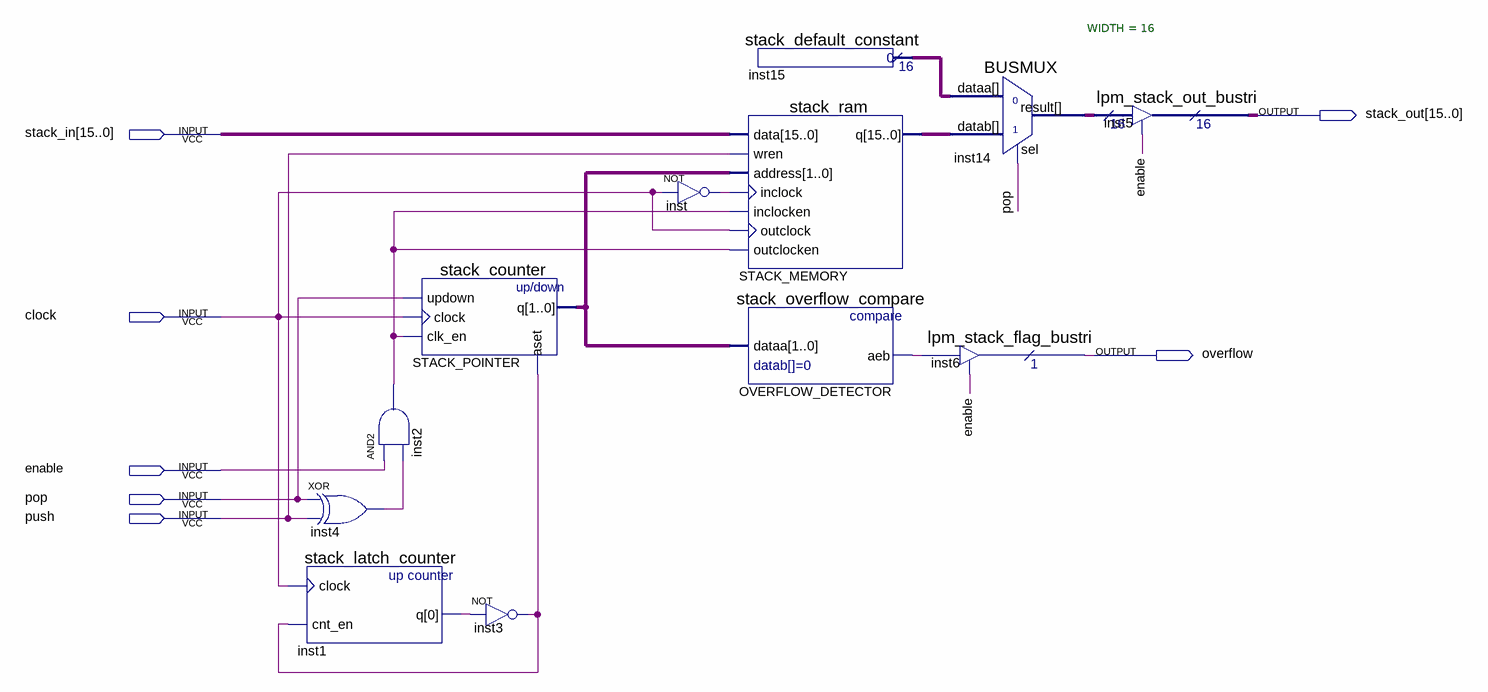
[diagram p0: schematic sheet]
// Quartus schematic Stack.bdf as structural Verilog: 12 symbols, 7 pins
module Stack (
  input  [15:0] stack_in,
  input  clock,
  input  enable,
  input  pop,
  input  push,
  output [15:0] stack_out,
  output overflow
);

  wire inst1_q, inst2_out, inst3_out, inst4_out, inst_out, OVERFLOW_DETECTOR_aeb;
  wire [1:0] STACK_POINTER_q;
  wire [15:0] inst14_result, inst15_result, STACK_MEMORY_q;

  xor inst4 (inst4_out, pop, push);
  stack_latch_counter inst1 (.clock(clock), .cnt_en(inst3_out), .q(inst1_q));
  and inst2 (inst2_out, enable, inst4_out);
  stack_counter STACK_POINTER (.updown(pop), .clock(clock), .clk_en(inst2_out), .aset(inst3_out), .q(STACK_POINTER_q));
  not inst3 (inst3_out, inst1_q);
  not inst (inst_out, clock);
  stack_default_constant inst15 (.result(inst15_result));
  stack_ram STACK_MEMORY (
    .data(stack_in), .wren(push), .address(STACK_POINTER_q), .inclock(inst_out), .inclocken(inst2_out),
    .outclock(clock), .outclocken(inst2_out), .q(STACK_MEMORY_q));
  stack_overflow_compare OVERFLOW_DETECTOR (.dataa(STACK_POINTER_q), .aeb(OVERFLOW_DETECTOR_aeb));
  lpm_stack_flag_bustri inst6 (.enabledt(enable), .data(OVERFLOW_DETECTOR_aeb), .tridata(overflow));
  BUSMUX #(.WIDTH(16)) inst14 (.datab(STACK_MEMORY_q), .sel(pop), .dataa(inst15_result), .result(inst14_result));
  lpm_stack_out_bustri inst5 (.enabledt(enable), .data(inst14_result), .tridata(stack_out));
endmodule
